# Altium schematic sheet Functional Diagram.SchDoc
size A4; SheetNumber: 6; SheetTotal: 6
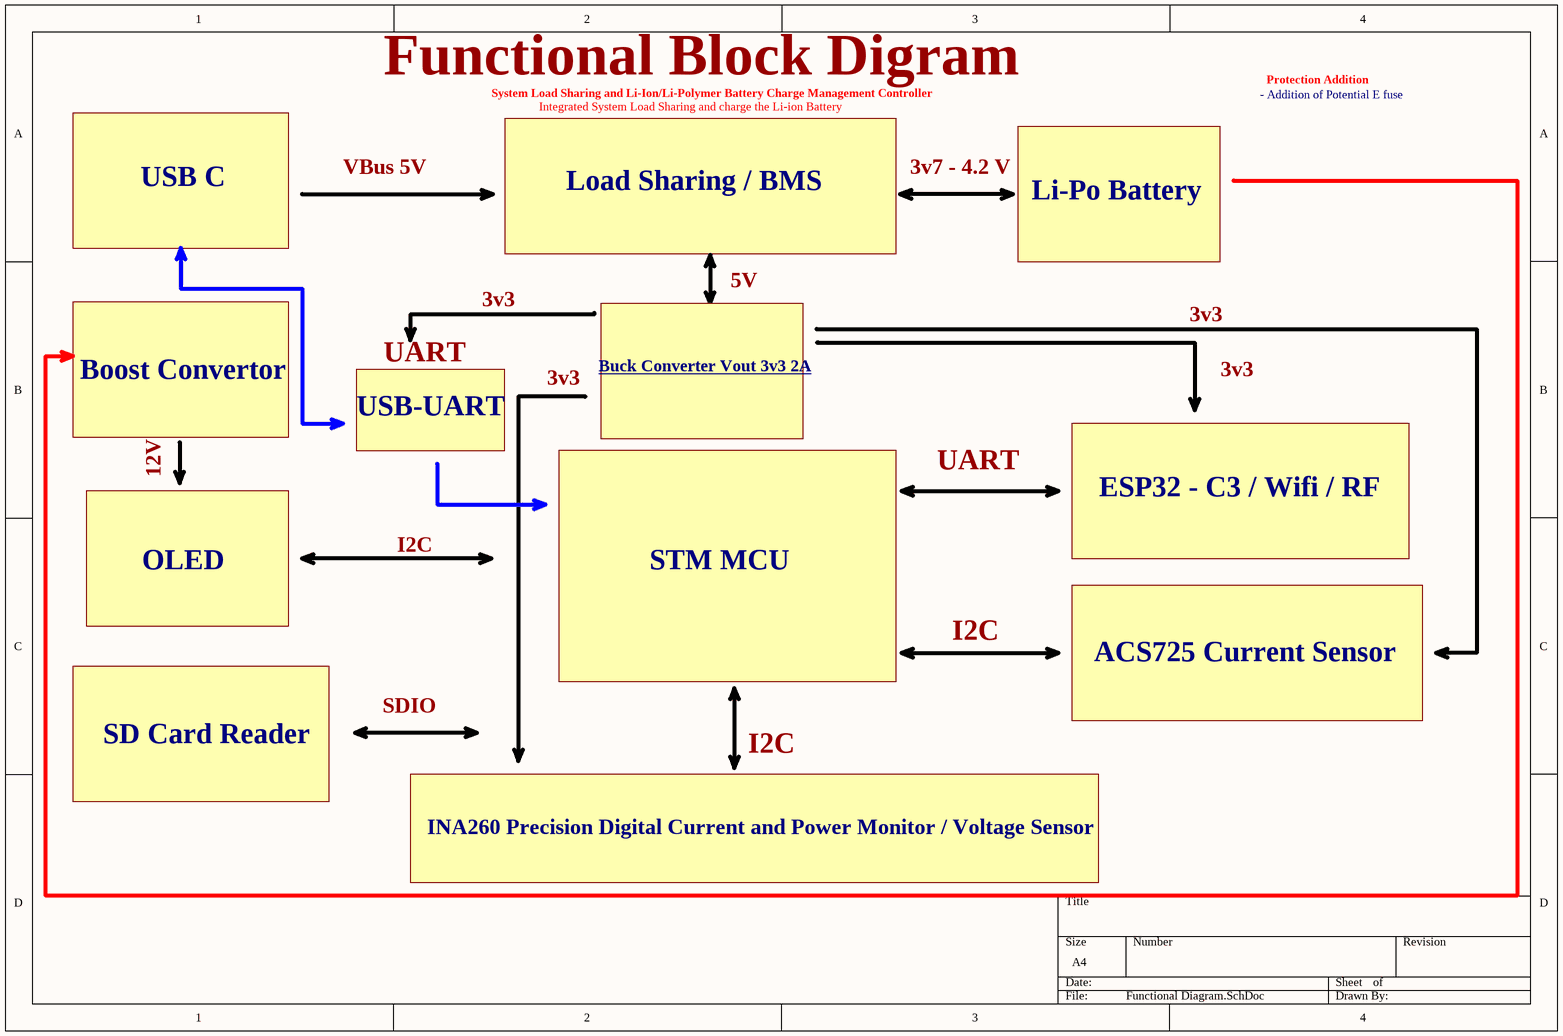
[diagram p0: Functional Diagram.SchDoc]

## Notes on the sheet
- Functional Block Digram
- System Load Sharing and Li-Ion/Li-Polymer Battery Charge Management Controller
- Integrated System Load Sharing and charge the Li-ion Battery
- - Addition of Potential E fuse
- Protection Addition
- VBus 5V
- 3v7 - 4.2 V
- USB C
- Load Sharing / BMS
- Li-Po Battery
- 3v3
- 5V
- Boost Convertor
- UART
- Buck Converter Vout 3v3 2A <https://4donline.ihs.com/images/VipMasterIC/IC/DIOD/DIOD-S-A0007089856/DIOD-S-A0007089856-1.pdf?hkey=CECEF36DEECDED6468708AAF2E19C0C6>
- USB-UART
- 12V
- ESP32 - C3 / Wifi / RF
- OLED
- I2C
- STM MCU
- SDIO
- ACS725 Current Sensor
- SD Card Reader
- INA260 Precision Digital Current and Power Monitor / Voltage Sensor